# Altium schematic sheet top_level.SchDoc
size A
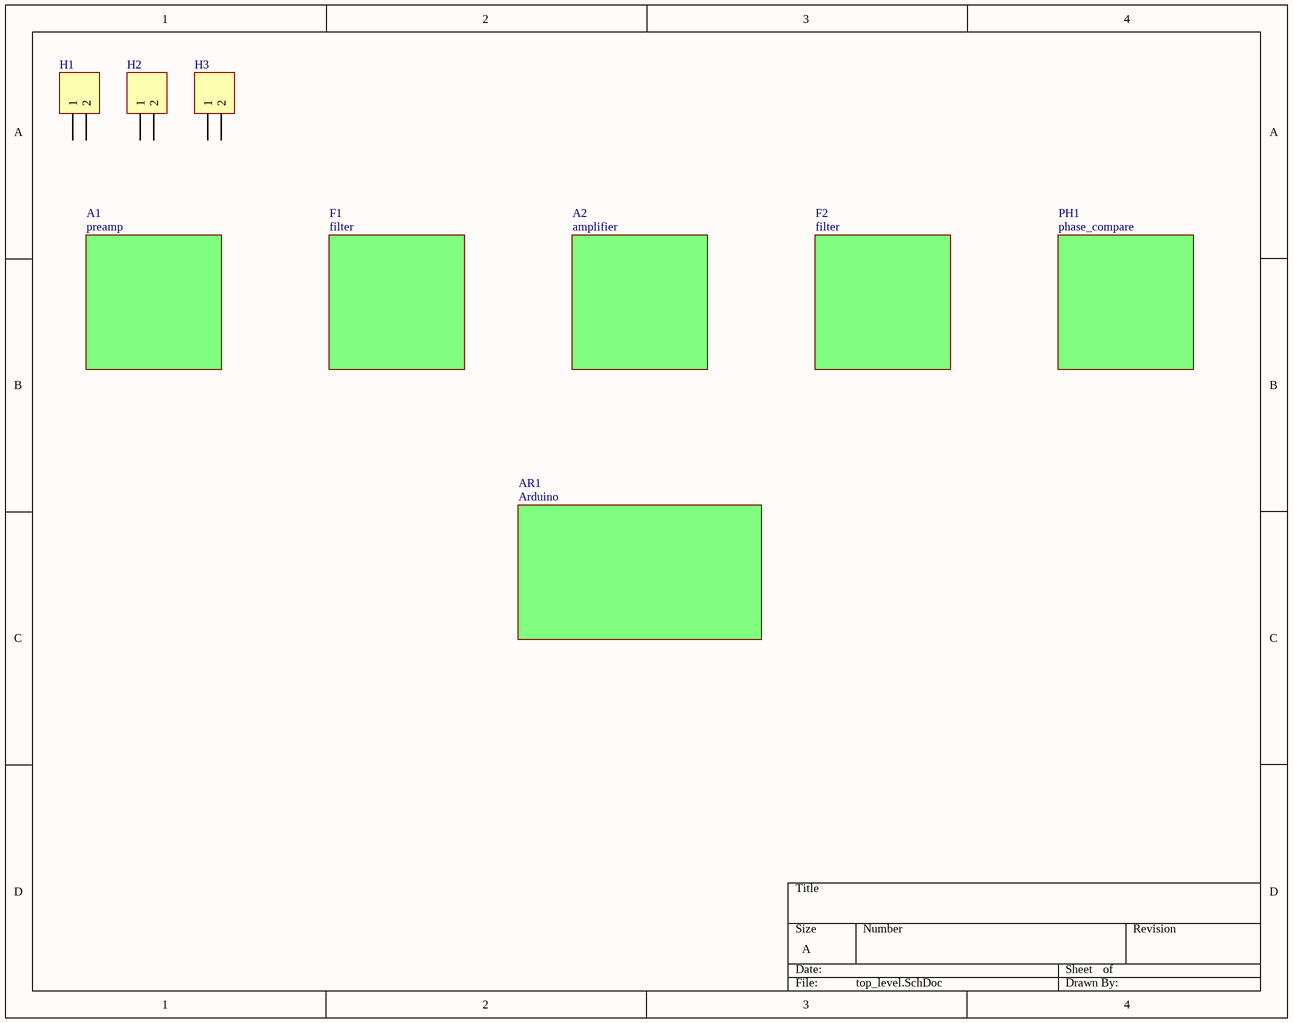
[diagram p0: top_level.SchDoc]

## Parts
H1  Header 2  [HDR1X2]  (value not drawn)
H2  Header 2  [HDR1X2]  (value not drawn)
H3  Header 2  [HDR1X2]  (value not drawn)

## Sub-sheets
A1 = preamp: no entries
A2 = amplifier: no entries
AR1 = Arduino: no entries
F1 = filter: no entries
F2 = filter: no entries
PH1 = phase_compare: no entries

## Nets

Not connected (* = marked no-connect by the designer): H1 1 2; H2 1 2; H3 1 2

## Library data of the parts
H1-H3 = Header 2: Header, 2-Pin; LatestRevisionDate: 17-Jul-2002; LatestRevisionNote: Re-released for DXP Platform.; Publisher: Altium Limited